# EAGLE design adalogger featherwing (EAGLE 6.6.0)
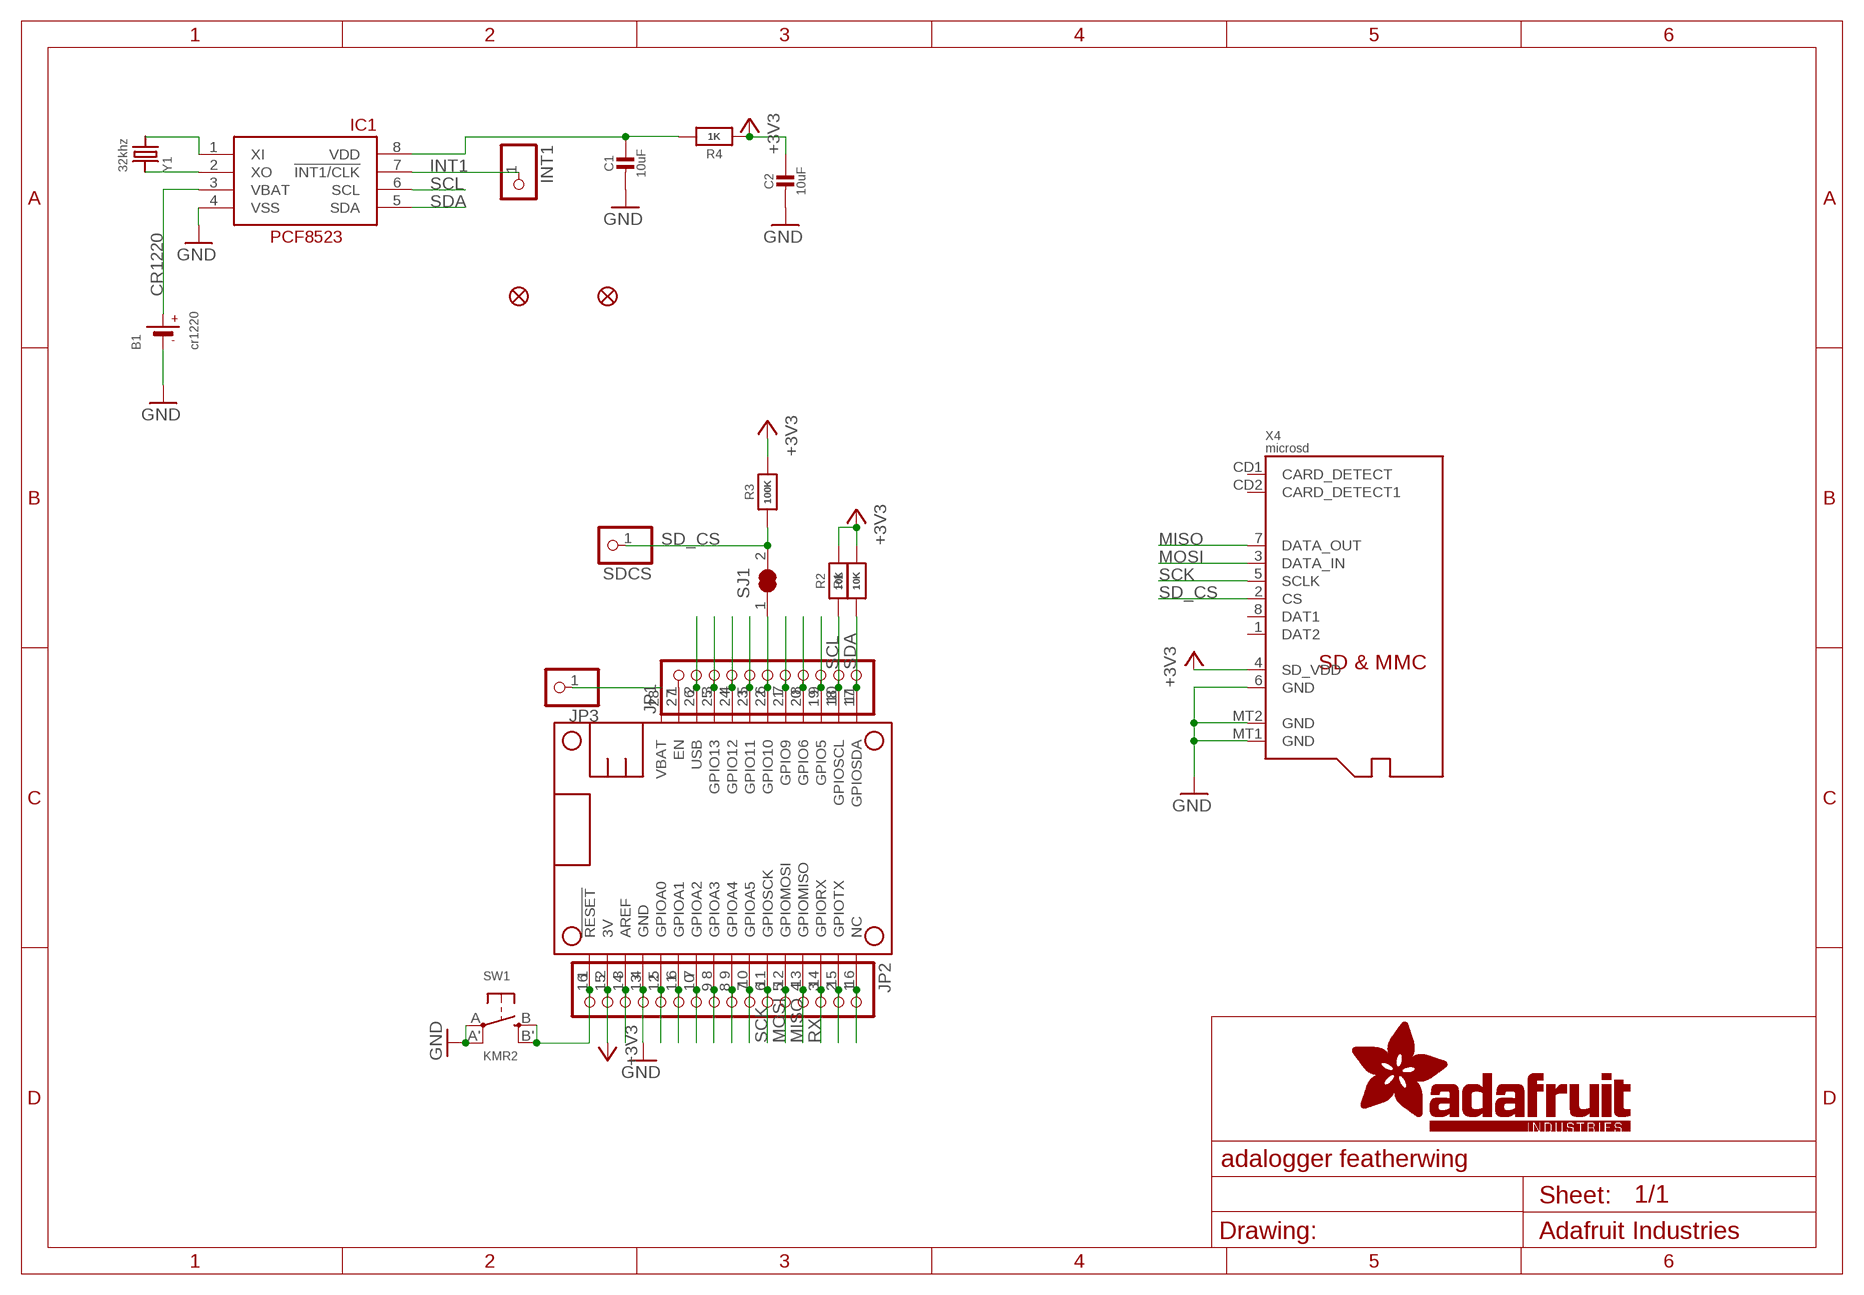
[diagram p0: schematic, sheet 1]

## Parts
B1  cr1220  BATTERYCR1220_2  [CR1220-2]
C1  10uF  CAP_CERAMIC0805-NOOUTLINE  [0805-NO]
C2  10uF  CAP_CERAMIC0805-NOOUTLINE  [0805-NO]
FID1  FIDUCIAL_1MM  [FIDUCIAL_1MM]
FID2  FIDUCIAL_1MM  [FIDUCIAL_1MM]
IC1  PCF8523T  RTC_PCF8523T  [SOIC8_150MIL]
INT1  HEADER-1X1ROUND  [1X01_ROUND]
JP1  HEADER-1X11  [1X11_ROUND]
JP2  HEADER-1X16ROUND  [1X16_ROUND]
JP3  HEADER-1X1ROUND  [1X01_ROUND]
MS1  FEATHERWING_NODIM  [FEATHERWING_NODIM]
R1  10K  RESISTOR_0603_NOOUT  [0603-NO]
R2  10K  RESISTOR_0603_NOOUT  [0603-NO]
R3  100K  RESISTOR_0603_NOOUT  [0603-NO]
R4  1K  RESISTOR_0603_NOOUT  [0603-NO]
SDCS  HEADER-1X1ROUND  [1X01_ROUND]
SJ1  SOLDERJUMPER_CLOSED  [SOLDERJUMPER_CLOSEDWIRE]
SW1  KMR2  SWITCH_TACT_SMT4.6X2.8  [BTN_KMR2_4.6X2.8]
X4  microsd  MICROSD  [MICROSD]
Y1  32khz  CRYSTAL8.0X3.8  [CRYSTAL_8X3.8]

## Nets
+3V3: C2.1 JP2.15 MS1.2(3V) R1.2 R2.2 R3.2 R4.1 X4.4(SD_VDD)
A: JP2.12 MS1.5(GPIOA0)
AREF: JP2.14 MS1.3(AREF)
B: JP2.11 MS1.6(GPIOA1)
C: JP2.10 MS1.7(GPIOA2)
CR1220: B1.+ IC1.3(VBAT)
CS: JP1.6 MS1.22(GPIO10) SJ1.1
D: JP2.9 MS1.8(GPIOA3)
E: JP2.8 MS1.9(GPIOA4)
EN: JP1.1 MS1.27(EN)
F: JP2.7 MS1.10(GPIOA5)
G: JP2.1 MS1.16(NC)
GND: B1.- C1.2 C2.2 IC1.4(VSS) JP2.13 MS1.4(GND) SW1.A'(P1) SW1.A(P) X4.6(GND) X4.MT1(GND) X4.MT2(GND)
H: JP1.9 MS1.19(GPIO5)
I: JP1.8 MS1.20(GPIO6)
INT1: IC1.7(!INT1/CLK) INT1.1
J: JP1.7 MS1.21(GPIO9)
L: JP1.5 MS1.23(GPIO11)
M: JP1.4 MS1.24(GPIO12)
MISO: JP2.4 MS1.13(GPIOMISO) X4.7(DATA_OUT)
MOSI: JP2.5 MS1.12(GPIOMOSI) X4.3(DATA_IN)
N: JP1.3 MS1.25(GPIO13)
N$1: C1.1 IC1.8(VDD) R4.2
N$7: IC1.1(XI) Y1.P$4
N$8: IC1.2(XO) Y1.P$1
RESET: JP2.16 MS1.1(!RESET) SW1.B'(S1) SW1.B(S)
RX: JP2.3 MS1.14(GPIORX)
SCK: JP2.6 MS1.11(GPIOSCK) X4.5(SCLK)
SCL: IC1.6(SCL) JP1.10 MS1.18(GPIOSCL) R2.1
SD_CS: R3.1 SDCS.1 SJ1.2 X4.2(CS)
SDA: IC1.5(SDA) JP1.11 MS1.17(GPIOSDA) R1.1
TX: JP2.2 MS1.15(GPIOTX)
USB: JP1.2 MS1.26(USB)
VBAT: JP3.1 MS1.28(VBAT)
Unconnected: X4.1(DAT2) X4.8(DAT1) X4.CD1(CARD_DETECT) X4.CD2(CARD_DETECT1)

## Library data of the parts
B1 = microbuilder:BATTERY: CR1220 SMT - Digikey: 3001K-ND CD2032 BAT-HLD-001 - Digikey: BAT-HLD-001-ND
C1 C2 = microbuilder:CAP_CERAMIC: Ceramic Capacitors For new designs, use the packages preceded by an '_' character since they are more reliable: The following footprints should be used on most boards: _0402 - Standard footprint for regular board layouts _0603 - Standard footprint for regular board layouts _0805 - Standard footprint for regular board layouts _1206 - Standard footprint for regular board layouts For extremely tight-pitch boards where space is at a premium, the following 'micro-pitch' footprints can be used (smaller pads, no silkscreen outline, etc.): _0402MP - Micro-pitch footprint for very dense/compact boards _0603MP - Micro-pitch footprint for very dense/compact boards _0805MP - Micro-pitch footprint for very dense/compact boards _1206MP - Micro-pitch footprint for very dense/compact boards
FID1 FID2 = microbuilder:FIDUCIAL: Fiducial Alignment Points Various fiducial points for machine vision alignment.; BOM: EXCLUDE
IC1 = microbuilder:RTC_PCF8523
INT1 JP3 SDCS = microbuilder:HEADER-1X1: PIN HEADER
JP1 = microbuilder:HEADER-1X11
JP2 = microbuilder:HEADER-1X16: PIN HEADER
MS1 = microbuilder:FEATHERWING
R1-R4 = microbuilder:RESISTOR: Resistors For new designs, use the packages preceded by an '_' character since they are more reliable: The following footprints should be used on most boards: _0402 - Standard footprint for regular board layouts _0603 - Standard footprint for regular board layouts _0805 - Standard footprint for regular board layouts _1206 - Standard footprint for regular board layouts For extremely tight-pitch boards where space is at a premium, the following 'micro-pitch' footprints can be used (smaller pads, no silkscreen outline, etc.): _0402MP - Micro-pitch footprint for very dense/compact boards _0603MP - Micro-pitch footprint for very dense/compact boards _0805MP - Micro-pitch footprint for very dense/compact boards _1206MP - Micro-pitch footprint for very dense/compact boards
SJ1 = microbuilder:SOLDERJUMPER_CLOSED: Solder Jumper - Closed These solder jumpers are closed by default CLOSEDWIRE - 10 mil trace between pads that can be cut and resoldered later CLOSEDPERM - 63 mil trace between pads for a permanent connection (used to 'bridge' two signals, a shameless hack for Eagle). Can double as a test point as well (no cream layer)
SW1 = microbuilder:SWITCH_TACT_SMT: SMT Tact Switches 6x6mm - Digikey: P12940SCT-ND KMR2 (4.6x2.8mm) - Digikey: 401-1426-1-ND EVQ-PQHB55 - Light Touch, 160GF (4.5x4.5mm) - Digikey: P8090SCT-ND KMT0 - KMT021 NGJ LHS (etc.) IP68/Waterproof - Digikey: CKN10289CT-ND
X4 = microbuilder:MICROSD: MicroSD/Transflash Card Holder with SPI pinout 3M: 2908-05WB-MG 4UConnector: 19656 Footprint courtesy: Adafruit Industries
Y1 = microbuilder:CRYSTAL: Crystals HC49UP - Surface Mount Crystal 4.0MHz 18pF +/-30ppm Surface Mount Crystal [Digikey: 535-9857-1-ND] 12.0 MHz Surface Mount Crystal [Digikey: 535-9869-6-ND] 25.0 MHz Surface Mount Crystal [Digikey: 535-9078-1-ND] 2.5 x 2.0mm - MEMs SMT Crystal 16.0 MHz 10pF 20ppm 2.5 x 2.0mm Crystal [Digikey -40-85°C: 535-10923-1-ND] 3.2 x 2.5mm - MEMs SMT Crystal 12.0 MHz 8pF 15ppm 3.2 x 2.5mm Crystal [Digikey: -10-70°C: 644-1047-1-ND -40-125°C: 644-1128-1-ND] 40~85°C cheaper: 644-1173-6-ND 16.0 MHz 8pF 15ppm 3.2 x 2.5mm Crystal [Digikey: -10-70°C: 644-1049-1-ND -40-125°C: 644-1129-2-ND]-40~85°C cheaper: 644-1175-6-ND 16.0 MHz 10pF 10ppm 3.2 x 2.5mm Crystal [Digikey: 644-1100-1-ND] 27.12 MHz 18pF 30ppm 3.2 x 2.5mm Crystal [Digikey: 887-1424-1-ND] 27.12MHz 10pF 10ppm 3.2 x 2.5mm Crystal [Digikey: 887-1329-1-ND] 4.9 x 1.8mm - MEMs SMT Crystal 32.768 KHz 12.5pF 20ppm 4.9 x 1.8mm Crystal [Digikey: SE2415CT-ND] 8.0 x 3.8mm - Surface Mount Crystal 32.768kHz 12.5pF 20ppm -40°C-85°C [Digikey: 535-9166-2-ND] Cylinder 32.768KHz Cylinder Crystal (2x6mm body) [Ex. Digikey: 300-8341-2-ND]

## Board
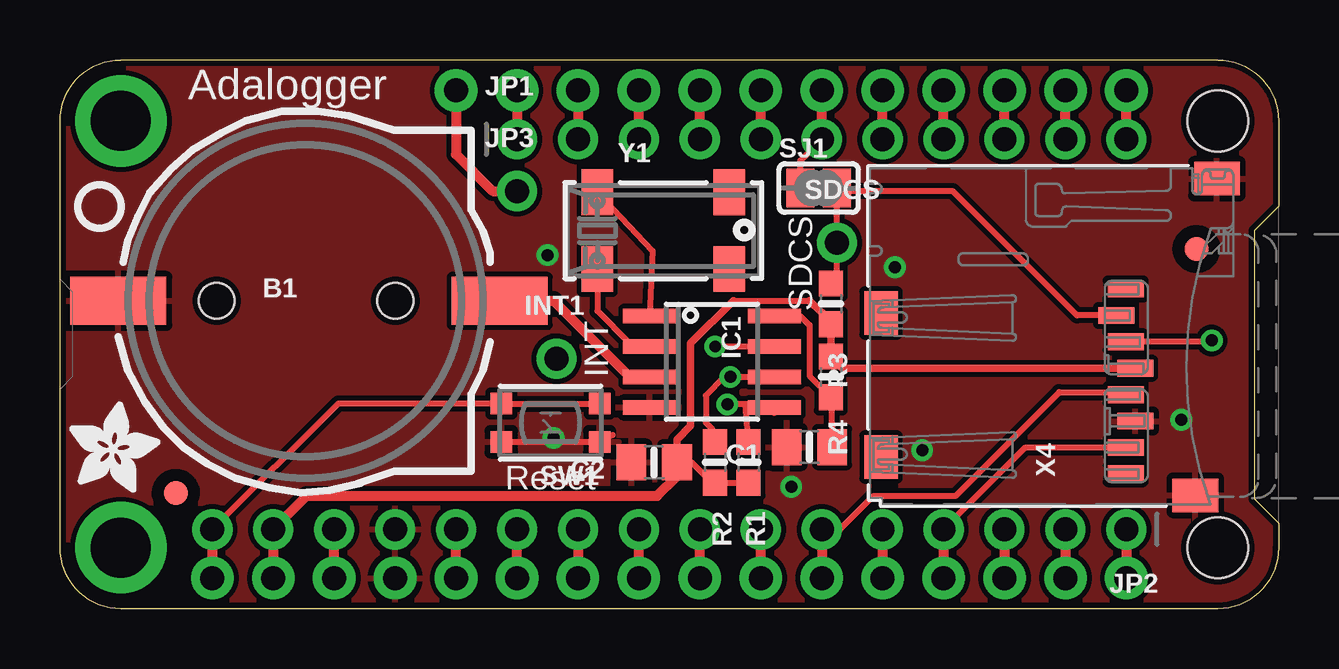
[diagram p1: board, top side]
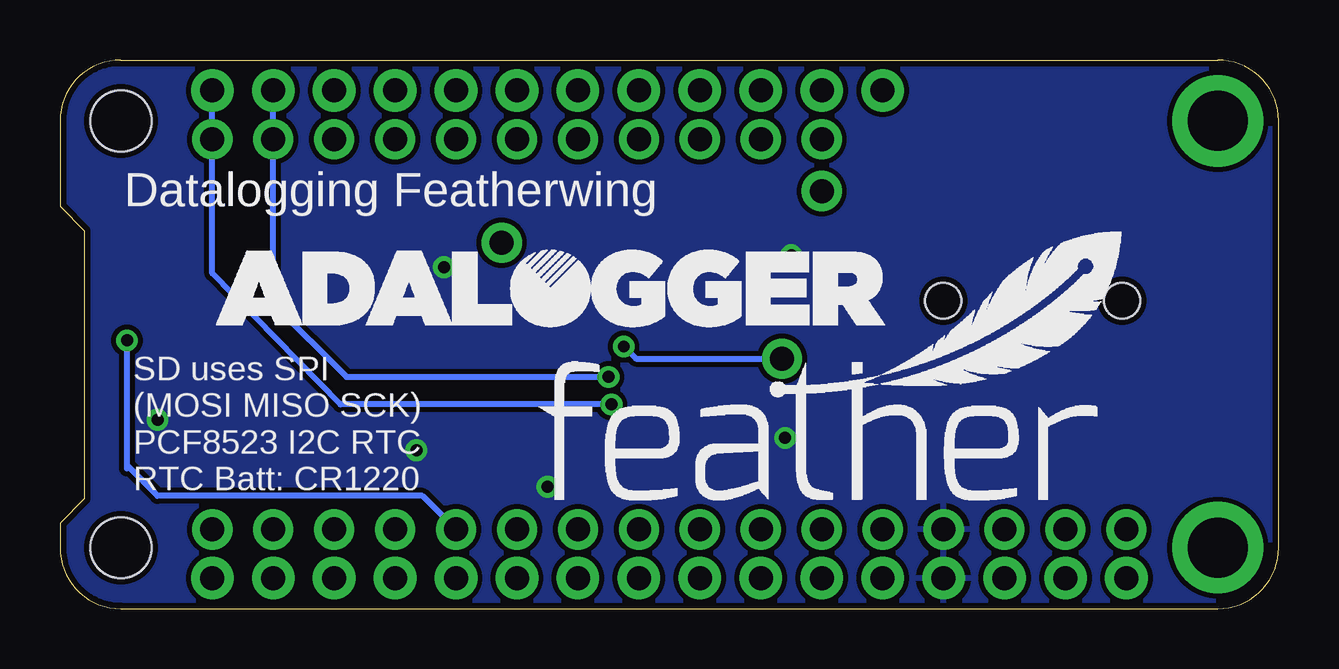
[diagram p2: board, bottom side, seen from below]

Size 50.8 x 22.86 mm. Coordinates in mm from the lower left corner, seen from the top.
Outline: 48.26,22.86 arc-90 50.8,20.32 50.8,16.76 49.78,15.75 49.78,4.57 50.8,3.56 50.8,2.54 arc-90 48.26,0 2.54,0 arc-90 0,2.54 0,20.32 arc-90 2.54,22.86 48.26,22.86
Copper layers (1*16): Top 0.035mm / dielectric 1.5mm / Bottom 0.035mm
Design rules "adafruit *": minimum track width 8mil, minimum drill 15.5mil, track to track 8mil, track to pad 8mil, pad to pad 8mil, via to via 8mil, smd to smd 8mil, copper to edge 10mil, drill to drill 8mil, minimum pad ring 10mil, minimum via ring 8mil, stop-mask expansion 2mil, vias tented up to drill 20mil, thermal gap 10mil

### Footprints (pad centres in the part's own frame; a part is rotated, then mirrored left to right if it is on the bottom)
CR1220-2 = smd 4 x 2: + 8.29,0; - -7.6,0 | hole 1.5: 3.95,0; -3.5,0
0805-NO = smd 1.24 x 1.5: 1 -0.95,0; 2 0.95,0
FIDUCIAL_1MM = smd 1 x 1: 1 0,0
SOIC8_150MIL = smd 0.6 x 2.2: 1 -1.905,-2.6; 2 -0.635,-2.6; 3 0.635,-2.6; 4 1.905,-2.6; 5 1.905,2.6; 6 0.635,2.6; 7 -0.635,2.6; 8 -1.905,2.6
1X01_ROUND = drill 1 pad 1.676: 1 0,0
1X11_ROUND = drill 1 pad 1.676: 1 -12.7,0; 2 -10.16,0; 3 -7.62,0; 4 -5.08,0; 5 -2.54,0; 6 0,0; 7 2.54,0; 8 5.08,0; 9 7.62,0; 10 10.16,0; 11 12.7,0
1X16_ROUND = drill 1 pad 1.676: 1 -19.05,0; 2 -16.51,0; 3 -13.97,0; 4 -11.43,0; 5 -8.89,0; 6 -6.35,0; 7 -3.81,0; 8 -1.27,0; 9 1.27,0; 10 3.81,0; 11 6.35,0; 12 8.89,0; 13 11.43,0; 14 13.97,0; 15 16.51,0; 16 19.05,0
FEATHERWING_NODIM = drill 1 pad 1.778: 1 6.35,1.27; 2 8.89,1.27; 3 11.43,1.27; 4 13.97,1.27; 5 16.51,1.27; 6 19.05,1.27; 7 21.59,1.27; 8 24.13,1.27; 9 26.67,1.27; 10 29.21,1.27; 11 31.75,1.27; 12 34.29,1.27; 13 36.83,1.27; 14 39.37,1.27; 15 41.91,1.27; 16 44.45,1.27; 17 44.45,21.59; 18 41.91,21.59; 19 39.37,21.59; 20 36.83,21.59; 21 34.29,21.59; 22 31.75,21.59; 23 29.21,21.59; 24 26.67,21.59; 25 24.13,21.59; 26 21.59,21.59; 27 19.05,21.59; 28 16.51,21.59 | drill 2.5 pad 3.81: P$1 2.54,20.32; P$2 2.54,2.54 | hole 2.54: 48.26,20.32; 48.26,2.54
0603-NO = smd 1.075 x 1: 1 -0.85,0; 2 0.85,0
SOLDERJUMPER_CLOSEDWIRE = smd 1.168 x 1.6: 1 -0.762,0; 2 0.762,0 | smd 0.635 x 0.203: WIRE 0,0
BTN_KMR2_4.6X2.8 = smd 0.9 x 0.9: A 2.05,0.8; A' -2.05,0.8; B 2.05,-0.8; B' -2.05,-0.8
MICROSD = smd 0.7 x 1.5: 1 9,-10.64; 2 7.9,-10.24; 3 6.8,-10.64; 4 5.7,-11.04; 5 4.6,-10.64; 6 3.5,-11.04; 7 2.4,-10.64; 8 1.3,-10.64 | smd 1.8 x 1.4: CD1 2,-0.44; CD2 8,-0.44 | smd 1.4 x 1.9: MT1 0.4,-13.54; MT2 13.6,-14.44
CRYSTAL_8X3.8 = smd 1.3 x 1.9: P$1 -2.75,-1.6; P$2 2.75,-1.6; P$3 2.75,1.6; P$4 -2.75,1.6

### Placement (x,y rotation side)
B1  10.03,12.83 0 top
C1  31.24,6.73 180 top
C2  24.77,6.1 180 top
FID1  47.37,14.99 0 top
FID2  4.83,4.83 0 top
IC1  27.18,10.29 270 top
INT1  20.7,10.41 0 top
JP1  31.75,19.56 0 top
JP2  25.4,3.3 180 top
JP3  19.05,17.4 0 top
MS1  0,0 0 top
R1  28.7,6.1 270 top
R2  27.3,6.1 270 top
R3  32.13,12.7 270 top
R4  32.13,9.65 270 top
SDCS  32.38,15.24 0 top
SJ1  31.62,17.53 0 top
SW1  20.45,7.75 180 top
U$2  [FEATHERLOGO]  30.86,4.45 0 bottom
U$3  [ADALOGGER_LOGO]  44.32,11.68 0 bottom
U$4  [ADAFRUIT_3.5MM]  0.38,4.83 0 top
U$5  [PCBFEAT-REV-040]  1.65,16.76 0 top
X4  33.78,4.32 90 top
Y1  25.15,15.75 0 top

### Tracks (layer width: path | path; a pad name or v marks a point on that pad's centre or on a via)
+3V3
  Top 0.254: R1.2 R2.2 26.84,5.59 26.33,6.1 C2.1 | 28.07,12.83 31.24,12.83 | 31.75,12.32 31.79,12.32
  Top 0.305: 28.07,12.83 26.29,11.05 26.29,7.87 26.29,7.62 25.71,7.05 C2.1 | 31.24,12.83 31.75,12.32 | 31.79,12.32 R3.2 R4.1 32.62,10.02 X4.4
  Top 0.406: MS1.2 JP2.15 10.29,4.7 24.89,4.7 25.71,5.52 C2.1
A
  Top 0.406: MS1.5 JP2.12
AREF
  Top 0.406: MS1.3 JP2.14
B
  Top 0.406: MS1.6 JP2.11
C
  Top 0.406: JP2.10 MS1.7
CR1220
  Top 0.406: B1.+ 20.57,12.83 23.75,9.65 IC1.3
CS
  Top 0.254: SJ1.1 30.86,18.67 JP1.6
  Top 0.406: JP1.6 MS1.22
D
  Top 0.406: MS1.8 JP2.9
E
  Top 0.406: MS1.9 JP2.8
EN
  Top 0.406: MS1.27 JP1.1
F
  Top 0.406: MS1.10 JP2.7
G
  Top 0.406: JP2.1 MS1.16
GND  (via drill 0.5)
  Top 0.254: SW1.A SW1.A' 23.04,7.24
  other vias: 20.32,14.73 46.74,7.87 34.8,14.22 20.57,7.11 35.94,6.6 30.48,5.08
  pour Top: 0,22.86 0,0 50.8,0 50.8,22.86
  pour Bottom: 0,22.86 0,0 50.8,0 50.8,22.86
H
  Top 0.406: JP1.9 MS1.19
I
  Top 0.406: JP1.8 MS1.20
INT1  (via drill 0.48)
  Top 0.254: IC1.7 v27.3,10.92
  Bottom 0.254: v27.3,10.92 26.8,10.41 INT1.1
J
  Top 0.406: JP1.7 MS1.21
L
  Top 0.406: JP1.5 MS1.23
M
  Top 0.406: JP1.4 MS1.24
MISO
  Top 0.254: X4.7 40.25,6.72 JP2.4
  Top 0.406: JP2.4 MS1.13
MOSI  (via drill 0.5)
  Top 0.254: v48.01,11.18 47.95,11.12 X4.3
  Top 0.406: JP2.5 MS1.12
  Bottom 0.254: 48.01,5.84 48.01,5.97 | 48.01,5.97 v48.01,11.18 | JP2.5 35.69,4.7 46.74,4.7 48.01,5.97
N
  Top 0.406: JP1.3 MS1.25
N$1
  Top 0.254: C1.1 R4.2 31.24,9.69 31.24,11.81 30.86,12.19 IC1.8
N$7
  Top 0.254: Y1.P$4 24.7,14.91 IC1.1
N$8
  Top 0.254: Y1.P$1 22.4,12.4 23.75,11.05 IC1.2
RESET
  Top 0.254: SW1.B' SW1.B 11.6,8.55 JP2.16
  Top 0.406: JP2.16 MS1.1
RX
  Top 0.406: JP2.3 MS1.14
SCK
  Top 0.254: JP2.6 32.51,3.3 33.91,4.7 37.34,4.7 41.66,9.02 44.32,9.02 X4.5
  Top 0.406: JP2.6 MS1.11
SCL  (via drill 0.5)
  Top 0.254: IC1.6 v27.94,9.65 27.69,9.65 26.92,8.89 26.92,7.75 27.18,7.49 R2.1
  Top 0.406: JP1.10 MS1.18
  Bottom 0.254: MS1.18 41.91,12.7 38.86,9.65 v27.94,9.65
SD_CS
  Top 0.254: X4.2 42.39,12.22 37.21,17.4 32.51,17.4 SJ1.2 SDCS.1 32.38,13.8 R3.1
SDA  (via drill 0.5)
  Top 0.254: 28.57,8.51 29.78,8.51 IC1.5 29.78,8.15 | 28.57,8.51 v27.81,8.51 | R1.1 28.57,8.51
  Top 0.406: JP1.11 MS1.17
  Bottom 0.254: v27.81,8.51 39.12,8.51 44.45,13.97 MS1.17
TX
  Top 0.406: JP2.2 MS1.15
USB
  Top 0.406: MS1.26 JP1.2
VBAT
  Top 0.406: MS1.28 16.51,18.92 18.03,17.4 JP3.1

### Text on the board
tPlace: Adalogger | SDCS | INT | Reset
bPlace: Datalogging Featherwing | SD uses SPI / (MOSI MISO SCK) / PCF8523 I2C RTC / RTC Batt: CR1220